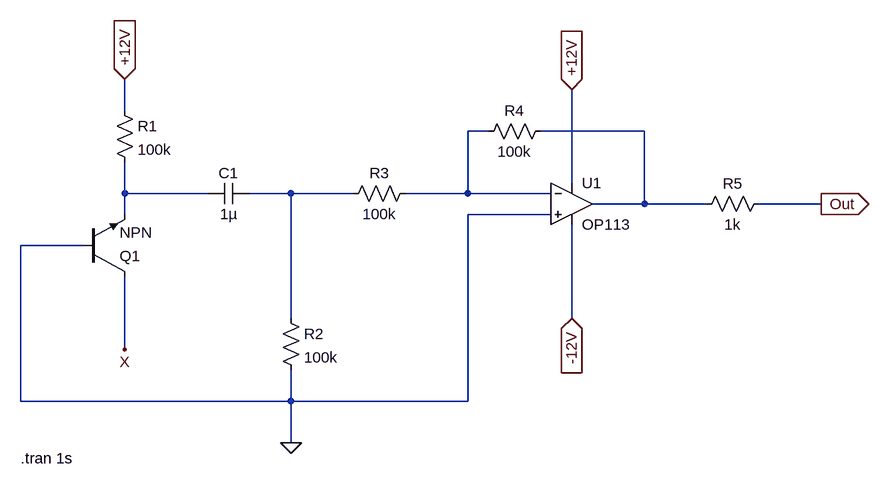
[diagram p0: schematic Transistor_Noise.asc]
Transistor_Noise.asc, the LTspice schematic file:
Version 4
SHEET 1 1460 680
WIRE 288 -96 288 -144
WIRE 848 -64 816 -64
WIRE 1088 -64 928 -64
WIRE 976 16 976 -128
WIRE 288 32 288 -16
WIRE 416 32 288 32
WIRE 544 32 480 32
WIRE 640 32 544 32
WIRE 816 32 816 -64
WIRE 816 32 720 32
WIRE 944 32 816 32
WIRE 1088 48 1088 -64
WIRE 1088 48 1008 48
WIRE 1184 48 1088 48
WIRE 1360 48 1264 48
WIRE 288 64 288 32
WIRE 944 64 816 64
WIRE 224 112 128 112
WIRE 544 224 544 32
WIRE 976 224 976 80
WIRE 288 272 288 160
WIRE 128 352 128 112
WIRE 544 352 544 304
WIRE 544 352 128 352
WIRE 816 352 816 64
WIRE 816 352 544 352
WIRE 544 416 544 352
FLAG 288 272 X
FLAG 288 -144 +12V
IOPIN 288 -144 In
FLAG 544 416 0
FLAG 976 224 -12V
IOPIN 976 224 In
FLAG 976 -128 +12V
IOPIN 976 -128 In
FLAG 1360 48 Out
IOPIN 1360 48 Out
SYMBOL npn 224 160 M180
SYMATTR InstName Q1
SYMBOL res 272 -112 R0
SYMATTR InstName R1
SYMATTR Value 100k
SYMBOL cap 480 16 R90
WINDOW 0 0 32 VBottom 2
WINDOW 3 32 32 VTop 2
SYMATTR InstName C1
SYMATTR Value 1µ
SYMBOL res 528 208 R0
SYMATTR InstName R2
SYMATTR Value 100k
SYMBOL OpAmps\\OP113 976 -16 R0
SYMATTR InstName U1
SYMBOL res 944 -80 R90
WINDOW 0 0 56 VBottom 2
WINDOW 3 32 56 VTop 2
SYMATTR InstName R4
SYMATTR Value 100k
SYMBOL res 1280 32 R90
WINDOW 0 0 56 VBottom 2
WINDOW 3 32 56 VTop 2
SYMATTR InstName R5
SYMATTR Value 1k
SYMBOL res 736 16 R90
WINDOW 0 0 56 VBottom 2
WINDOW 3 32 56 VTop 2
SYMATTR InstName R3
SYMATTR Value 100k
TEXT 128 440 Left 2 !.tran 1s

The netlist it stands for:
* Transistor_Noise.asc
Q1 X 0 N003 0 NPN
R1 +12V N003 100k
C1 N004 N003 1µ
R2 N004 0 100k
XU1 0 N001 +12V -12V N002 OP113  ; pins In+ In- V+ V- OUT
R4 N002 N001 100k
R5 Out N002 1k
R3 N001 N004 100k
.model NPN NPN
.model PNP PNP
.lib standard.bjt
.tran 1s
.lib ADI.lib
.backanno
.end